# EAGLE design HP85_Tape (EAGLE 9.2.2)

## Sheet 1 of 2
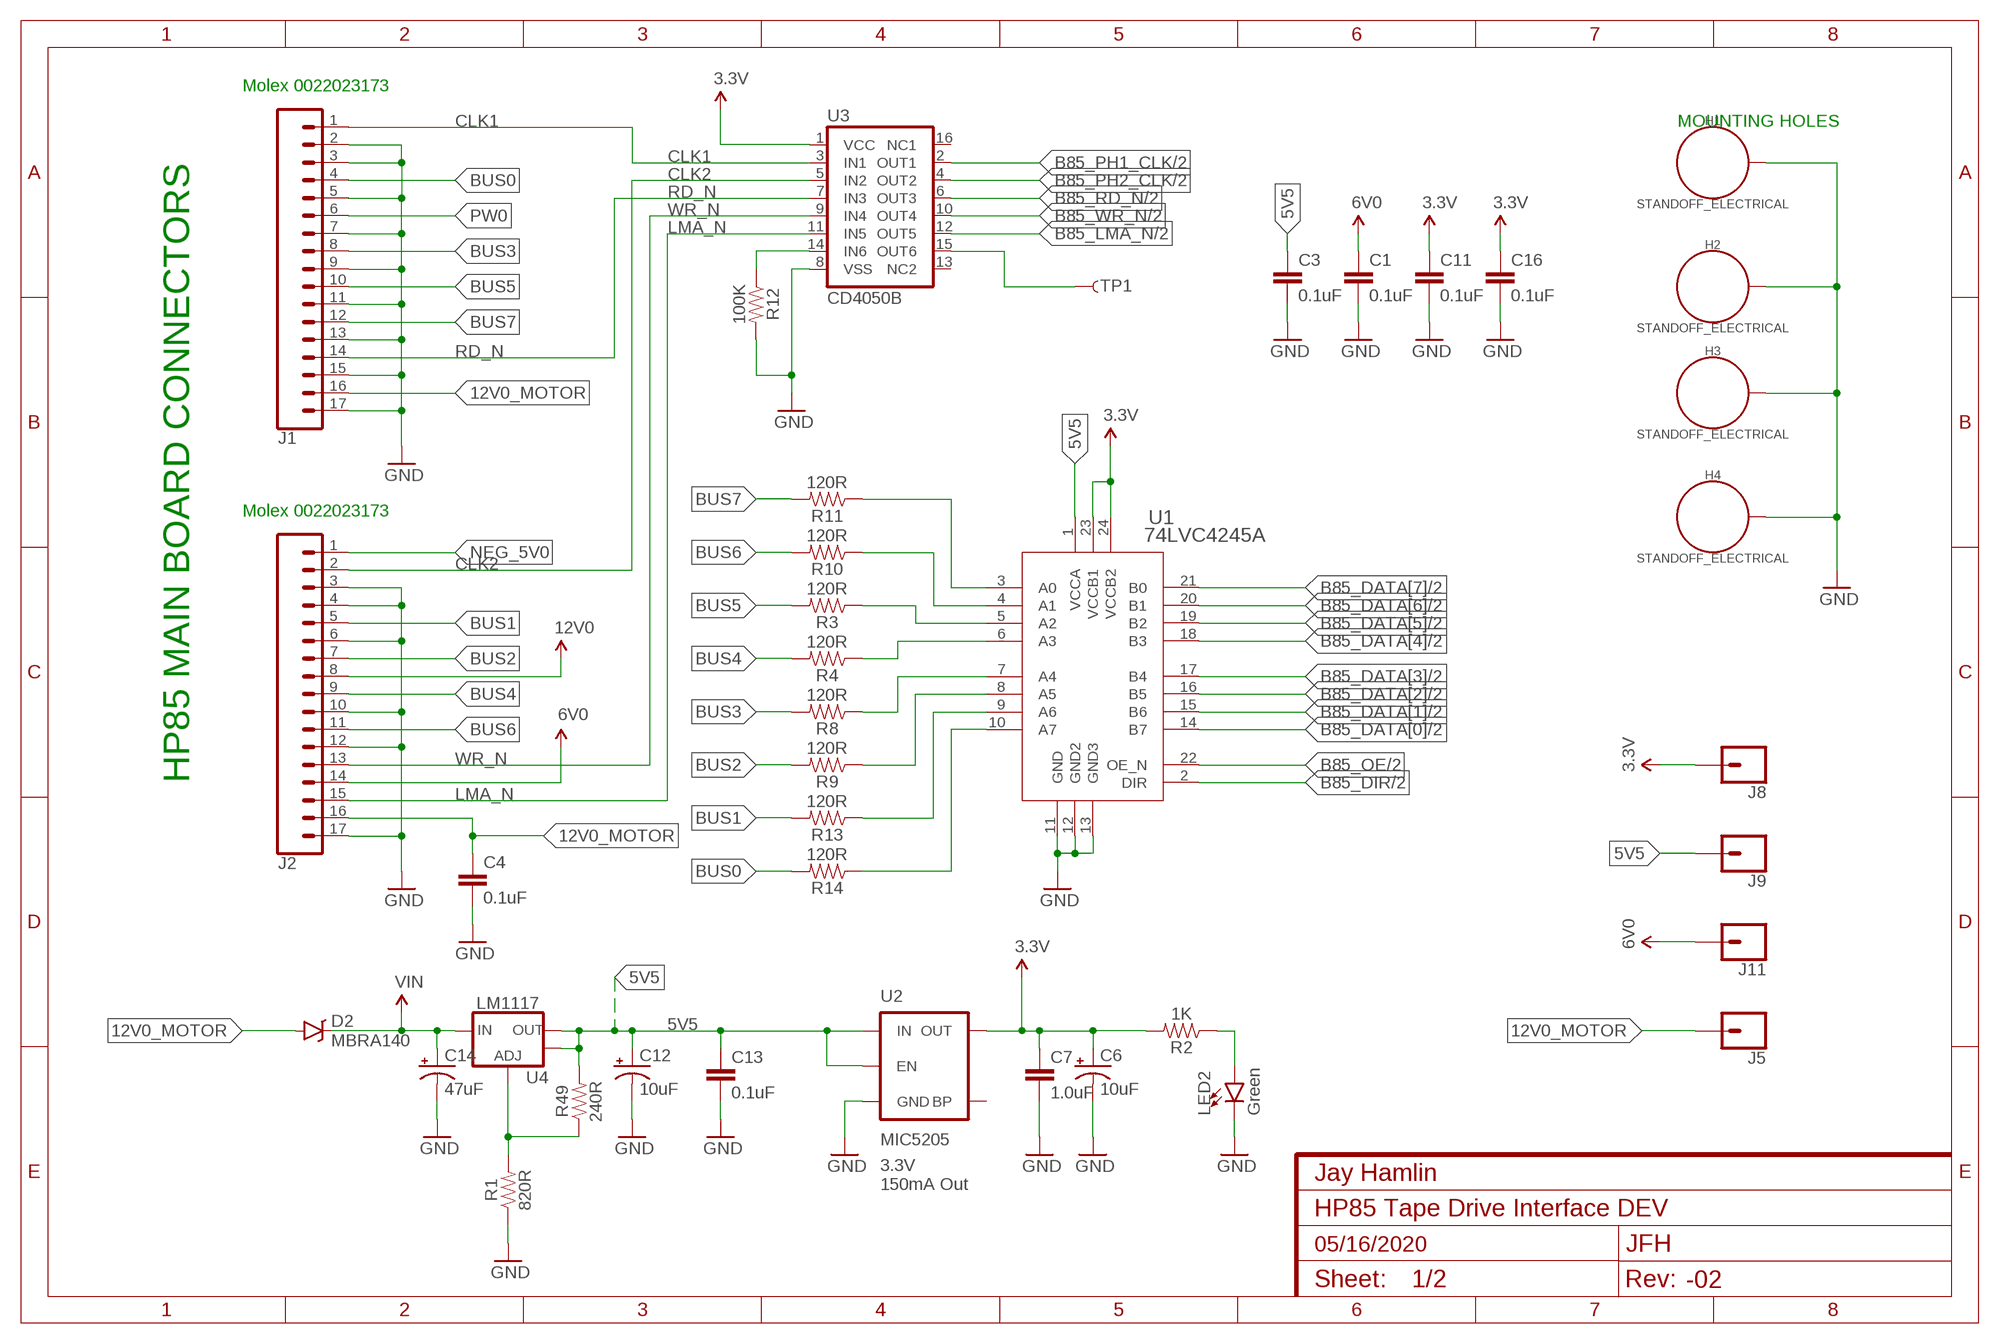
[diagram p0: schematic, sheet 1]

### Parts
C1  0.1uF  0.1UF-0603-25V-(+80/-20%)  [0603]
C3  0.1uF  0.1UF-0603-25V-(+80/-20%)  [0603]
C4  0.1uF  0.1UF-0603-25V-(+80/-20%)  [0603]
C6  10uF  10UF-POLAR-EIA3216-16V-10%(TANT)  [EIA3216]
C7  1.0uF  1.0UF-0603-16V-10%  [0603]
C11  0.1uF  0.1UF-0603-25V-(+80/-20%)  [0603]
C12  10uF  10UF-POLAR-EIA3216-16V-10%(TANT)  [EIA3216]
C13  0.1uF  0.1UF-0603-25V-(+80/-20%)  [0603]
C14  47uF  47UF-POLAR-PANASONIC_D-35V-20%  [PANASONIC_D]
C16  0.1uF  0.1UF-0603-25V-(+80/-20%)  [0603]
D2  MBRA140  [SMA-DIODE]
H1  STANDOFF_ELECTRICAL  [STANDOFF-ELECTRICAL]
H2  STANDOFF_ELECTRICAL  [STANDOFF-ELECTRICAL]
H3  STANDOFF_ELECTRICAL  [STANDOFF-ELECTRICAL]
H4  STANDOFF_ELECTRICAL  [STANDOFF-ELECTRICAL]
J1  CONN_17  [1X17]
J2  CONN_17  [1X17]
J5  CONN_01  [1X01]
J8  CONN_01  [1X01]
J9  CONN_01  [1X01]
J11  CONN_01  [1X01]
LED2  Green  LED1206  [LED-1206]
R1  820R  715OHM-0603-1/10W-1%  [0603]
R2  1K  4.7KOHM-0603-1/10W-1%  [0603]
R3  120R  240OHM-0603-1/10W-1%  [0603]
R4  120R  240OHM-0603-1/10W-1%  [0603]
R8  120R  240OHM-0603-1/10W-1%  [0603]
R9  120R  240OHM-0603-1/10W-1%  [0603]
R10  120R  240OHM-0603-1/10W-1%  [0603]
R11  120R  240OHM-0603-1/10W-1%  [0603]
R12  100K  715OHM-0603-1/10W-1%  [0603]
R13  120R  240OHM-0603-1/10W-1%  [0603]
R14  120R  240OHM-0603-1/10W-1%  [0603]
R49  240R  240OHM-0603-1/10W-1%  [0603]
TP1  TP-3x5  TEST-POINT3X5  [PAD.03X.05]
U1  74LVC4245A  [SO-24-M]
U2  MIC5205  MIC52053.3V  [SOT23-5]
U3  CD4050B  CD4050BHCD  [SO16]
U4  LM1117  V_REG_LM1117ALT1  [SOT223-ALT1]

### Nets
3.3V: C6.+ C7.1 C11.1 C16.1 J8.1 R2.2 U1.23(VCCB1) U1.24(VCCB2) U2.5(OUT) U3.1(VCC) ; also sheet 2
5V5: C3.1 C12.+ C13.1 J9.1 R49.2 U1.1(VCCA) U2.1(IN) U2.3(EN) U4.2(OUT) U4.4(OUT)
6V0: C1.1 J2.14 J11.1
12V0: J2.8
12V0_MOTOR: C4.1 D2.A J1.16 J2.16 J5.1
B85_DATA[0]: U1.14(B7) ; also sheet 2
B85_DATA[1]: U1.15(B6) ; also sheet 2
B85_DATA[2]: U1.16(B5) ; also sheet 2
B85_DATA[3]: U1.17(B4) ; also sheet 2
B85_DATA[4]: U1.18(B3) ; also sheet 2
B85_DATA[5]: U1.19(B2) ; also sheet 2
B85_DATA[6]: U1.20(B1) ; also sheet 2
B85_DATA[7]: U1.21(B0) ; also sheet 2
B85_DIR: U1.2(DIR) ; also sheet 2
B85_LMA_N: U3.12(OUT5) ; also sheet 2
B85_OE: U1.22(OE_N) ; also sheet 2
B85_PH1_CLK: U3.2(OUT1) ; also sheet 2
B85_PH2_CLK: U3.4(OUT2) ; also sheet 2
B85_RD_N: U3.6(OUT3) ; also sheet 2
B85_WR_N: U3.10(OUT4) ; also sheet 2
BUS0: J1.4 R14.2
BUS1: J2.5 R13.2
BUS2: J2.7 R9.2
BUS3: J1.8 R8.2
BUS4: J2.9 R4.2
BUS5: J1.10 R3.2
BUS6: J2.11 R10.2
BUS7: J1.12 R11.2
CLK1: J1.1 U3.3(IN1)
CLK2: J2.2 U3.5(IN2)
GND: C1.2 C3.2 C4.2 C6.- C7.2 C11.2 C12.- C13.2 C14.- C16.2 H1.P1 H2.P1 H3.P1 H4.P1 J1.2 J1.3 J1.5 J1.7 J1.9 J1.11 J1.13 J1.15 J1.17 J2.3 J2.4 J2.6 J2.10 J2.12 J2.17 LED2.C R1.1 R12.2 U1.11(GND) U1.12(GND2) U1.13(GND3) U2.2(GND) U3.8(VSS) ; also sheet 2
LMA_N: J2.15 U3.11(IN5)
N$1: LED2.A R2.1
N$2: R1.2 R49.1 U4.1(ADJ)
N$3: R12.1 U3.14(IN6)
N$4: R14.1 U1.10(A7)
N$5: TP1.P$1 U3.15(OUT6)
N$9: R13.1 U1.9(A6)
N$11: R9.1 U1.8(A5)
N$12: R8.1 U1.7(A4)
N$13: R4.1 U1.6(A3)
N$15: R3.1 U1.5(A2)
N$18: R10.1 U1.4(A1)
N$19: R11.1 U1.3(A0)
NEG_5V0: J2.1
PW0: J1.6
RD_N: J1.14 U3.7(IN3)
VIN: C14.+ D2.C U4.3(IN)
WR_N: J2.13 U3.9(IN4)
Unconnected: U2.4(BP) U3.13(NC2) U3.16(NC1)

### Notes on the sheet
- Molex 0022023173
- MOUNTING HOLES
- Molex 0022023173
- HP85 MAIN BOARD CONNECTORS
- 3.3V
  150mA Out

## Sheet 2 of 2
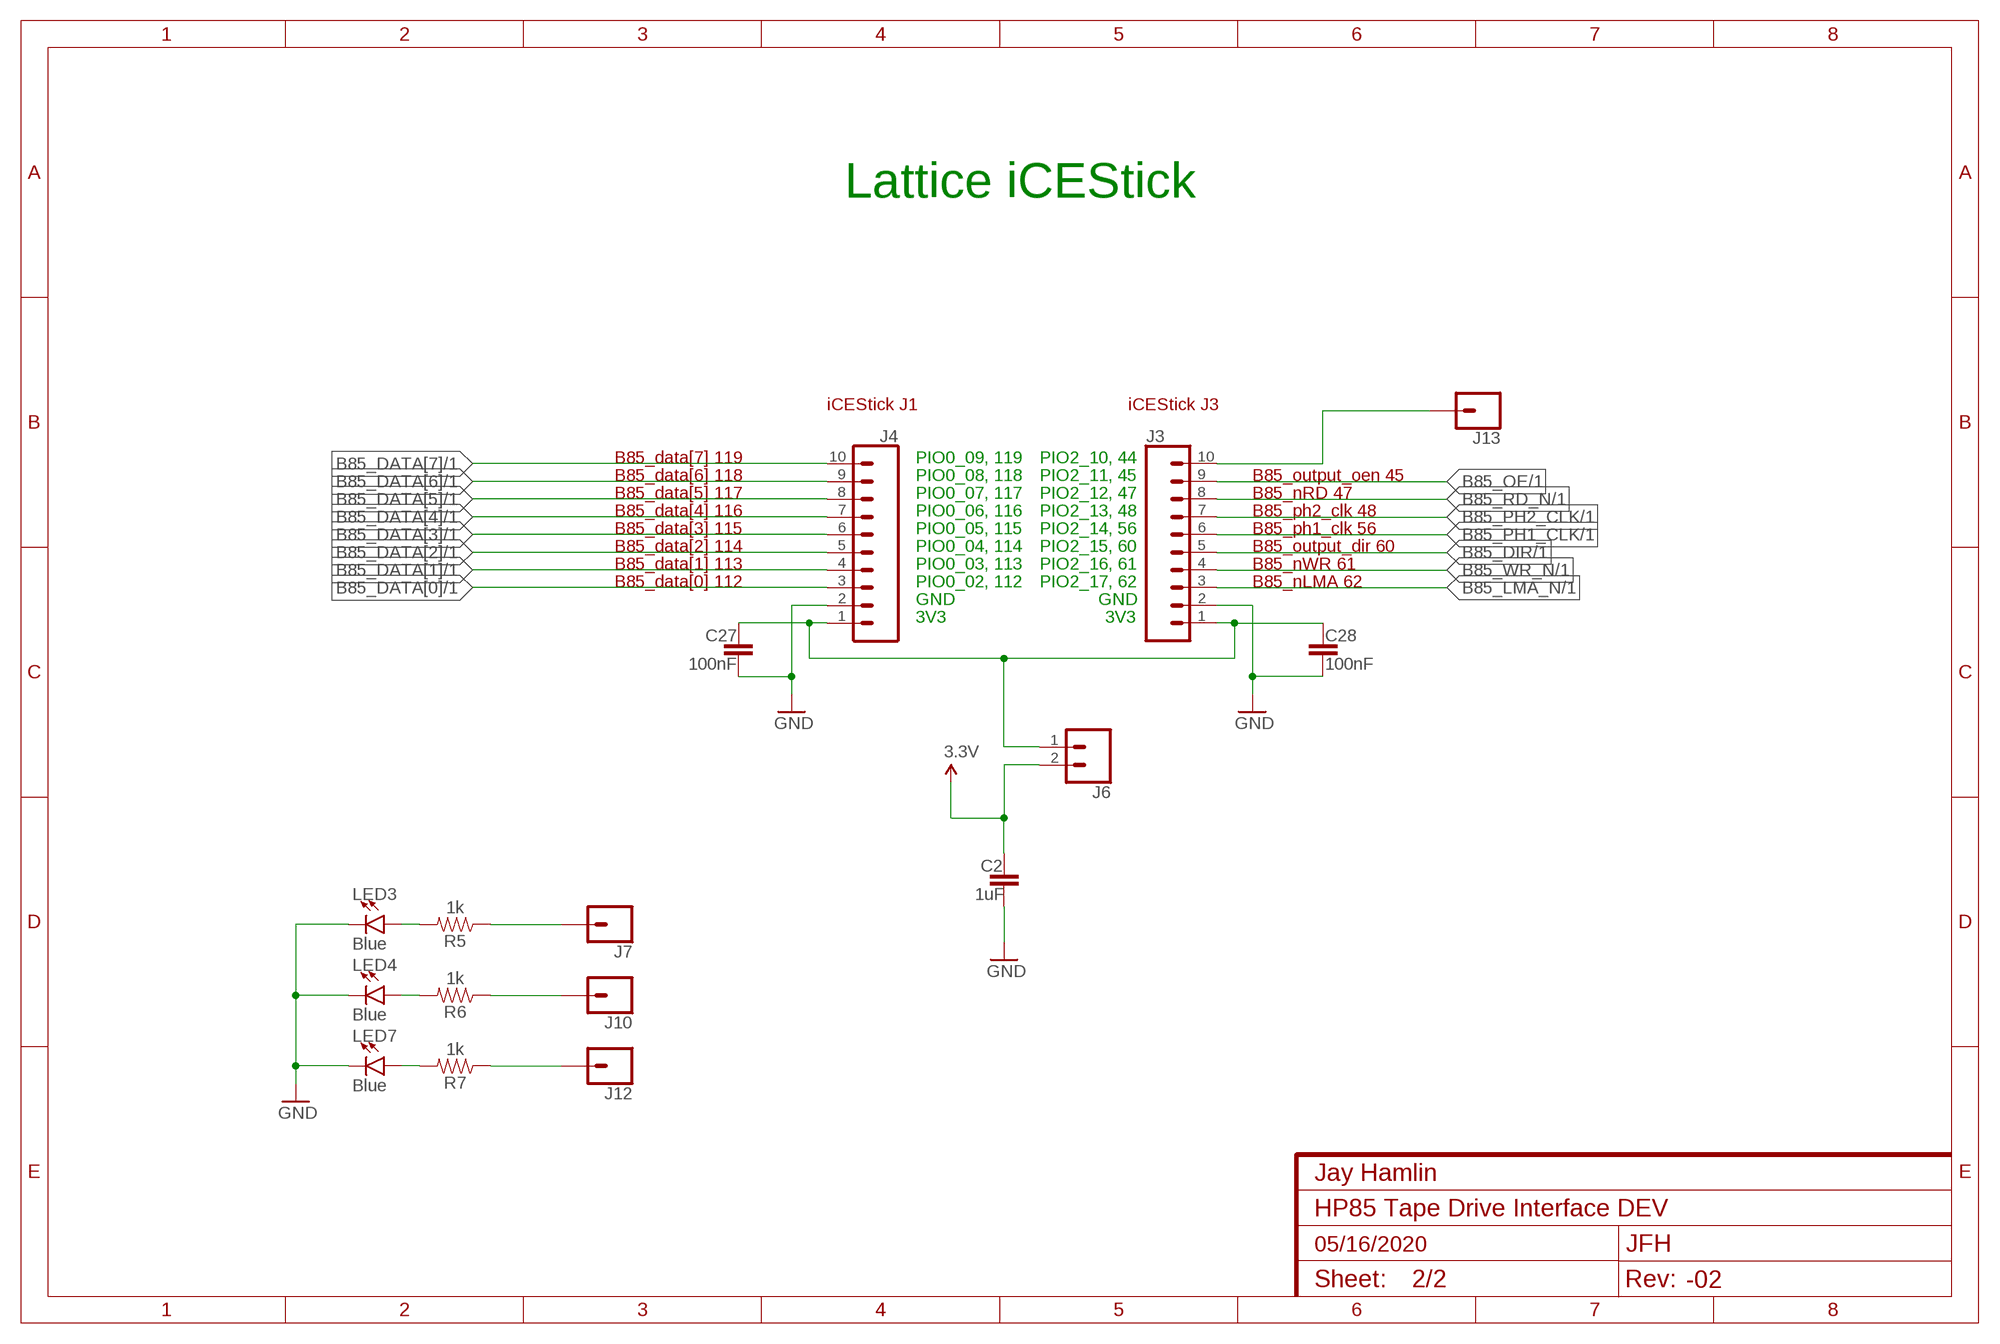
[diagram p1: schematic, sheet 2]

### Parts
C2  1uF  0.1UF-0603-25V-(+80/-20%)  [0603]
C27  100nF  0.1UF-0603-25V-(+80/-20%)  [0603]
C28  100nF  0.1UF-0603-25V-(+80/-20%)  [0603]
J3  CONN_10"  [1X10]
J4  CONN_10"  [1X10]
J6  CONN_02  [1X02]
J7  CONN_01  [1X01]
J10  CONN_01  [1X01]
J12  CONN_01  [1X01]
J13  CONN_01  [1X01]
LED3  Blue  LED1206  [LED-1206]
LED4  Blue  LED1206  [LED-1206]
LED7  Blue  LED1206  [LED-1206]
R5  1k  1KOHM-0603-1/10W-1%  [0603]
R6  1k  1KOHM-0603-1/10W-1%  [0603]
R7  1k  1KOHM-0603-1/10W-1%  [0603]

### Nets
3.3V: C2.1 J6.2 ; also sheet 1
B85_DATA[0]: J4.3 ; also sheet 1
B85_DATA[1]: J4.4 ; also sheet 1
B85_DATA[2]: J4.5 ; also sheet 1
B85_DATA[3]: J4.6 ; also sheet 1
B85_DATA[4]: J4.7 ; also sheet 1
B85_DATA[5]: J4.8 ; also sheet 1
B85_DATA[6]: J4.9 ; also sheet 1
B85_DATA[7]: J4.10 ; also sheet 1
B85_DIR: J3.5 ; also sheet 1
B85_LMA_N: J3.3 ; also sheet 1
B85_OE: J3.9 ; also sheet 1
B85_PH1_CLK: J3.6 ; also sheet 1
B85_PH2_CLK: J3.7 ; also sheet 1
B85_RD_N: J3.8 ; also sheet 1
B85_WR_N: J3.4 ; also sheet 1
GND: C2.2 C27.2 C28.2 J3.2 J4.2 LED3.C LED4.C LED7.C ; also sheet 1
N$6: LED3.A R5.2
N$7: LED4.A R6.2
N$8: LED7.A R7.2
N$10: J12.1 R7.1
N$14: C27.1 C28.1 J3.1 J4.1 J6.1
N$16: J10.1 R6.1
N$17: J7.1 R5.1
N$20: J3.10 J13.1

### Notes on the sheet
- Lattice iCEStick
- iCEStick J1 | iCEStick J3
- B85_data[7] 119 | PIO0_09, 119 | PIO2_10, 44
- B85_data[6] 118 | PIO0_08, 118 | PIO2_11, 45 | B85_output_oen 45
- B85_data[5] 117 | PIO0_07, 117 | PIO2_12, 47 | B85_nRD 47
- B85_data[4] 116 | PIO0_06, 116 | PIO2_13, 48 | B85_ph2_clk 48
- B85_data[3] 115 | PIO0_05, 115 | PIO2_14, 56 | B85_ph1_clk 56
- B85_data[2] 114 | PIO0_04, 114 | PIO2_15, 60 | B85_output_dir 60
- B85_data[1] 113 | PIO0_03, 113 | PIO2_16, 61 | B85_nWR 61
- B85_data[0] 112 | PIO0_02, 112 | PIO2_17, 62 | B85_nLMA 62
- GND | GND
- 3V3 | 3V3

## Library data of the parts
C1 C3 C4 C11 C13 C16 = SparkFun-Capacitors:0.1UF: 0.1µF ceramic capacitors A capacitor is a passive two-terminal electrical component used to store electrical energy temporarily in an electric field.; PROD_ID: CAP-00810
C2 C27 C28 = SparkFun-Capacitors:0.1UF: 0.1µF ceramic capacitors A capacitor is a passive two-terminal electrical component used to store electrical energy temporarily in an electric field.; PROD_ID: CAP-00810; VALUE: 0.1uF
C6 C12 = SparkFun-Capacitors:10UF-POLAR: 10.0µF polarized capacitors A capacitor is a passive two-terminal electrical component used to store electrical energy temporarily in an electric field.; PROD_ID: CAP-00811
C7 = SparkFun-Capacitors:1.0UF: 1µF ceramic capacitors A capacitor is a passive two-terminal electrical component used to store electrical energy temporarily in an electric field.; PROD_ID: CAP-00868
C14 = SparkFun-Capacitors:47UF-POLAR: 47µF polarized capacitors A capacitor is a passive two-terminal electrical component used to store electrical energy temporarily in an electric field.; PROD_ID: CAP-08478
D2 = SparkFun-DiscreteSemi:MBRA140: 40V, 1A Schottky rectifier SMA/DO-214AC package DIO-08053; PROD_ID: DIO-08053
H1-H4 = SparkFun-Hardware:STANDOFF_ELECTRICAL: Stand Off Drill holes with an electrical connection. For example, use these to ground your board to a chassis. Example SparkFun Products Screw - Phillips Head (1/4", 4-40, 10 pack) <https://www.sparkfun.com/products/10453> (PRT-10453) Screw - Phillips Head (1/2", 4-40, 10 pack) <https://www.sparkfun.com/products/10452> (PRT-10452) Screw - Phillips Head (3/4", 4-40, 10 pack) <https://www.sparkfun.com/products/10451> (PRT-10451) Screw - Phillips Head (1", 4-40, 10 pack) <https://www.sparkfun.com/products/10450> (PRT-10450)
J1 J2 = SparkFun-Connectors:CONN_17: Multi connection point. Often used as Generic Header-pin footprint for 0.1 inch spaced/style header connections On any of the 0.1 inch spaced packages, you can populate with these: Break Away Headers - Straight <https://www.sparkfun.com/products/116> (PRT-00116) Break Away Male Headers - Right Angle <https://www.sparkfun.com/products/553> (PRT-00553) Female Headers <https://www.sparkfun.com/products/115> (PRT-00115) Break Away Headers - Machine Pin <https://www.sparkfun.com/products/117> (PRT-00117) Break Away Female Headers - Swiss Machine Pin <https://www.sparkfun.com/products/743> (PRT-00743) For SCREWTERMINALS and SPRING TERMINALS visit here: Screw Terimnals on SparkFun.com <https://www.sparkfun.com/search/results?term=Screw+Terminals> (5mm/3.5mm/2.54mm spacing) This device is also useful as a general connection point to wire up your design to another part of your project. Our various solder wires solder well into these plated through hole pads. Hook-Up Wire - Assortment (Stranded, 22 AWG) <https://www.sparkfun.com/products/11375> (PRT-11375) Hook-Up Wire - Assortment (Solid Core, 22 AWG) <https://www.sparkfun.com/products/11367> (PRT-11367) View the entire wire category on our website here <https://www.sparkfun.com/categories/141> Special notes: Molex polarized connector foot print use with SKU : PRT-08231 with associated crimp pins and housings. 1MM SMD Version SKU: PRT-10208 NOTES ON THE VARIANTS LOCK and LOCK_LONGPADS... This footprint was designed to help hold the alignment of a through-hole component (i.e. 6-pin header) while soldering it into place. You may notice that each hole has been shifted either up or down by 0.005 of an inch from it's more standard position (which is a perfectly straight line). This slight alteration caused the pins (the squares in the middle) to touch the edges of the holes. Because they are alternating, it causes a "brace" to hold the component in place. 0.005 has proven to be the perfect amount of "off-center" position when using our standard breakaway headers. Although looks a little odd when you look at the bare footprint, once you have a header in there, the alteration is very hard to notice. Also,if you push a header all the way into place, it is covered up entirely on the bottom side.
J3 J4 = SparkFun-Connectors:CONN_10: Multi connection point. Often used as Generic Header-pin footprint for 0.1 inch spaced/style header connections On any of the 0.1 inch spaced packages, you can populate with these: Break Away Headers - Straight <https://www.sparkfun.com/products/116> (PRT-00116) Break Away Male Headers - Right Angle <https://www.sparkfun.com/products/553> (PRT-00553) Female Headers <https://www.sparkfun.com/products/115> (PRT-00115) Break Away Headers - Machine Pin <https://www.sparkfun.com/products/117> (PRT-00117) Break Away Female Headers - Swiss Machine Pin <https://www.sparkfun.com/products/743> (PRT-00743) Arduino Stackable Header - 10 Pin <https://www.sparkfun.com/products/11376> (PRT-11376) For SCREWTERMINALS and SPRING TERMINALS visit here: Screw Terimnals on SparkFun.com <https://www.sparkfun.com/search/results?term=Screw+Terminals> (5mm/3.5mm/2.54mm spacing) This device is also useful as a general connection point to wire up your design to another part of your project. Our various solder wires solder well into these plated through hole pads. Hook-Up Wire - Assortment (Stranded, 22 AWG) <https://www.sparkfun.com/products/11375> (PRT-11375) Hook-Up Wire - Assortment (Solid Core, 22 AWG) <https://www.sparkfun.com/products/11367> (PRT-11367) View the entire wire category on our website here <https://www.sparkfun.com/categories/141> Special notes: Molex polarized connector foot print use with SKU : PRT-08231 with associated crimp pins and housings. 1MM SMD Version SKU: PRT-10208 NOTES ON THE VARIANTS LOCK and LOCK_LONGPADS... This footprint was designed to help hold the alignment of a through-hole component (i.e. 6-pin header) while soldering it into place. You may notice that each hole has been shifted either up or down by 0.005 of an inch from it's more standard position (which is a perfectly straight line). This slight alteration caused the pins (the squares in the middle) to touch the edges of the holes. Because they are alternating, it causes a "brace" to hold the component in place. 0.005 has proven to be the perfect amount of "off-center" position when using our standard breakaway headers. Although looks a little odd when you look at the bare footprint, once you have a header in there, the alteration is very hard to notice. Also,if you push a header all the way into place, it is covered up entirely on the bottom side.; PROD_ID: CONN-11563
J5 J7-J13 = SparkFun-Connectors:CONN_01: Single connection point. Often used as Generic Header-pin footprint for 0.1 inch spaced/style header connections On any of the 0.1 inch spaced packages, you can populate with these: Break Away Headers - Straight <https://www.sparkfun.com/products/116> (PRT-00116) Break Away Male Headers - Right Angle <https://www.sparkfun.com/products/553> (PRT-00553) Female Headers <https://www.sparkfun.com/products/115> (PRT-00115) Break Away Headers - Machine Pin <https://www.sparkfun.com/products/117> (PRT-00117) Break Away Female Headers - Swiss Machine Pin <https://www.sparkfun.com/products/743> (PRT-00743) This device is also useful as a general connection point to wire up your design to another part of your project. Our various solder wires solder well into these plated through hole pads. Hook-Up Wire - Assortment (Stranded, 22 AWG) <https://www.sparkfun.com/products/11375> (PRT-11375) Hook-Up Wire - Assortment (Solid Core, 22 AWG) <https://www.sparkfun.com/products/11367> (PRT-11367) View the entire wire category on our website here <https://www.sparkfun.com/categories/141> Special notes: SMTSO-256-ET is a "flush mount" nut for a 4-40 screw. We mostly use this on specialty testbeds; it is a nice way to connect hardware to your PCB at an adjustable hieght. Also note, the SNAP packages are for using a snappable style connector. We sell a baggie of snaps and they are also used on two LilyPad designs: Snap Assortment - 30 pack (male and female) <https://www.sparkfun.com/products/11347> (DEV-11347) LilyPad Arduino SimpleSnap <https://www.sparkfun.com/products/10941> (DEV-10941) LilyPad SimpleSnap Protoboard <https://www.sparkfun.com/products/10940> (DEV-10940)
J6 = SparkFun-Connectors:CONN_02: Multi connection point. Often used as Generic Header-pin footprint for 0.1 inch spaced/style header connections On any of the 0.1 inch spaced packages, you can populate with these: Break Away Headers - Straight <https://www.sparkfun.com/products/116> (PRT-00116) Break Away Male Headers - Right Angle <https://www.sparkfun.com/products/553> (PRT-00553) Female Headers <https://www.sparkfun.com/products/115> (PRT-00115) Break Away Headers - Machine Pin <https://www.sparkfun.com/products/117> (PRT-00117) Break Away Female Headers - Swiss Machine Pin <https://www.sparkfun.com/products/743> (PRT-00743) For SCREWTERMINALS and SPRING TERMINALS visit here: Screw Terimnals on SparkFun.com <https://www.sparkfun.com/search/results?term=Screw+Terminals> (5mm/3.5mm/2.54mm spacing) This device is also useful as a general connection point to wire up your design to another part of your project. Our various solder wires solder well into these plated through hole pads. Hook-Up Wire - Assortment (Stranded, 22 AWG) <https://www.sparkfun.com/products/11375> (PRT-11375) Hook-Up Wire - Assortment (Solid Core, 22 AWG) <https://www.sparkfun.com/products/11367> (PRT-11367) View the entire wire category on our website here <https://www.sparkfun.com/categories/141> Special notes: Molex polarized connector foot print use with: PRT-08233 with associated crimp pins and housings. 2.54_SCREWTERM for use with PRT-10571. 3.5mm Screw Terminal footprints for PRT-08084 5mm Screw Terminal footprints for use with PRT-08432
LED2 = SparkFun-LED:LED: LED (Generic) Standard schematic elements and footprints for 5mm, 3mm, 1206, and 0603 sized LEDs. Generic LEDs with no color specified.; PROD_ID: DIO-09910
LED3 LED4 LED7 = SparkFun-LED:LED: LED (Generic) Standard schematic elements and footprints for 5mm, 3mm, 1206, and 0603 sized LEDs. Generic LEDs with no color specified.; PROD_ID: DIO-09911
R1 R12 = SparkFun-Resistors:715OHM: 715Ω resistor A resistor is a passive two-terminal electrical component that implements electrical resistance as a circuit element. Resistors act to reduce current flow, and, at the same time, act to lower voltage levels within circuits.; PROD_ID: RES-07850; VALUE: 715
R2 = SparkFun-Resistors:4.7KOHM: 4.7kΩ resistor A resistor is a passive two-terminal electrical component that implements electrical resistance as a circuit element. Resistors act to reduce current flow, and, at the same time, act to lower voltage levels within circuits.; PROD_ID: RES-07857; VALUE: 4.7k
R3 R4 R8-R11 R13 R14 R49 = SparkFun-Resistors:240OHM: 240Ω resistor A resistor is a passive two-terminal electrical component that implements electrical resistance as a circuit element. Resistors act to reduce current flow, and, at the same time, act to lower voltage levels within circuits.; PROD_ID: RES-07849; VALUE: 240
R5-R7 = SparkFun-Resistors:1KOHM: 1kΩ resistor A resistor is a passive two-terminal electrical component that implements electrical resistance as a circuit element. Resistors act to reduce current flow, and, at the same time, act to lower voltage levels within circuits.; PROD_ID: RES-07856
TP1 = SparkFun-Connectors:TEST-POINT: Bare copper test points for troubleshooting or ICT
U1 = JaysOWL_Library:74LVC4245A
U2 = SparkFun-PowerIC:MIC5205: MIC5205 150mA vreg 3.3V - VREG-00822 5V - VREG-00823; PROD_ID: VREG-00822
U3 = JaysOWL_Library:CD4050B: Dual 4:1 Analog Mux Dual four-channel analog MULTIPLEXER / DEMULTIPLEXER SparkFun Products SparkFun Vernier Interface Shield <https://www.sparkfun.com/products/12858> (DEV-12858); PROD_ID: IC-13103; VALUE: 74HC4052D
U4 = Testing:V_REG_LM1117: Voltage Regulator LM1117 Standard adjustable voltage regulator but in SMD form. Spark Fun Electronics SKU : COM-00595; PROD_ID: VREG-08170

## Net classes
0 default: width 0.102 mm, drill 0.305 mm, clearance 0.102 mm

## Board
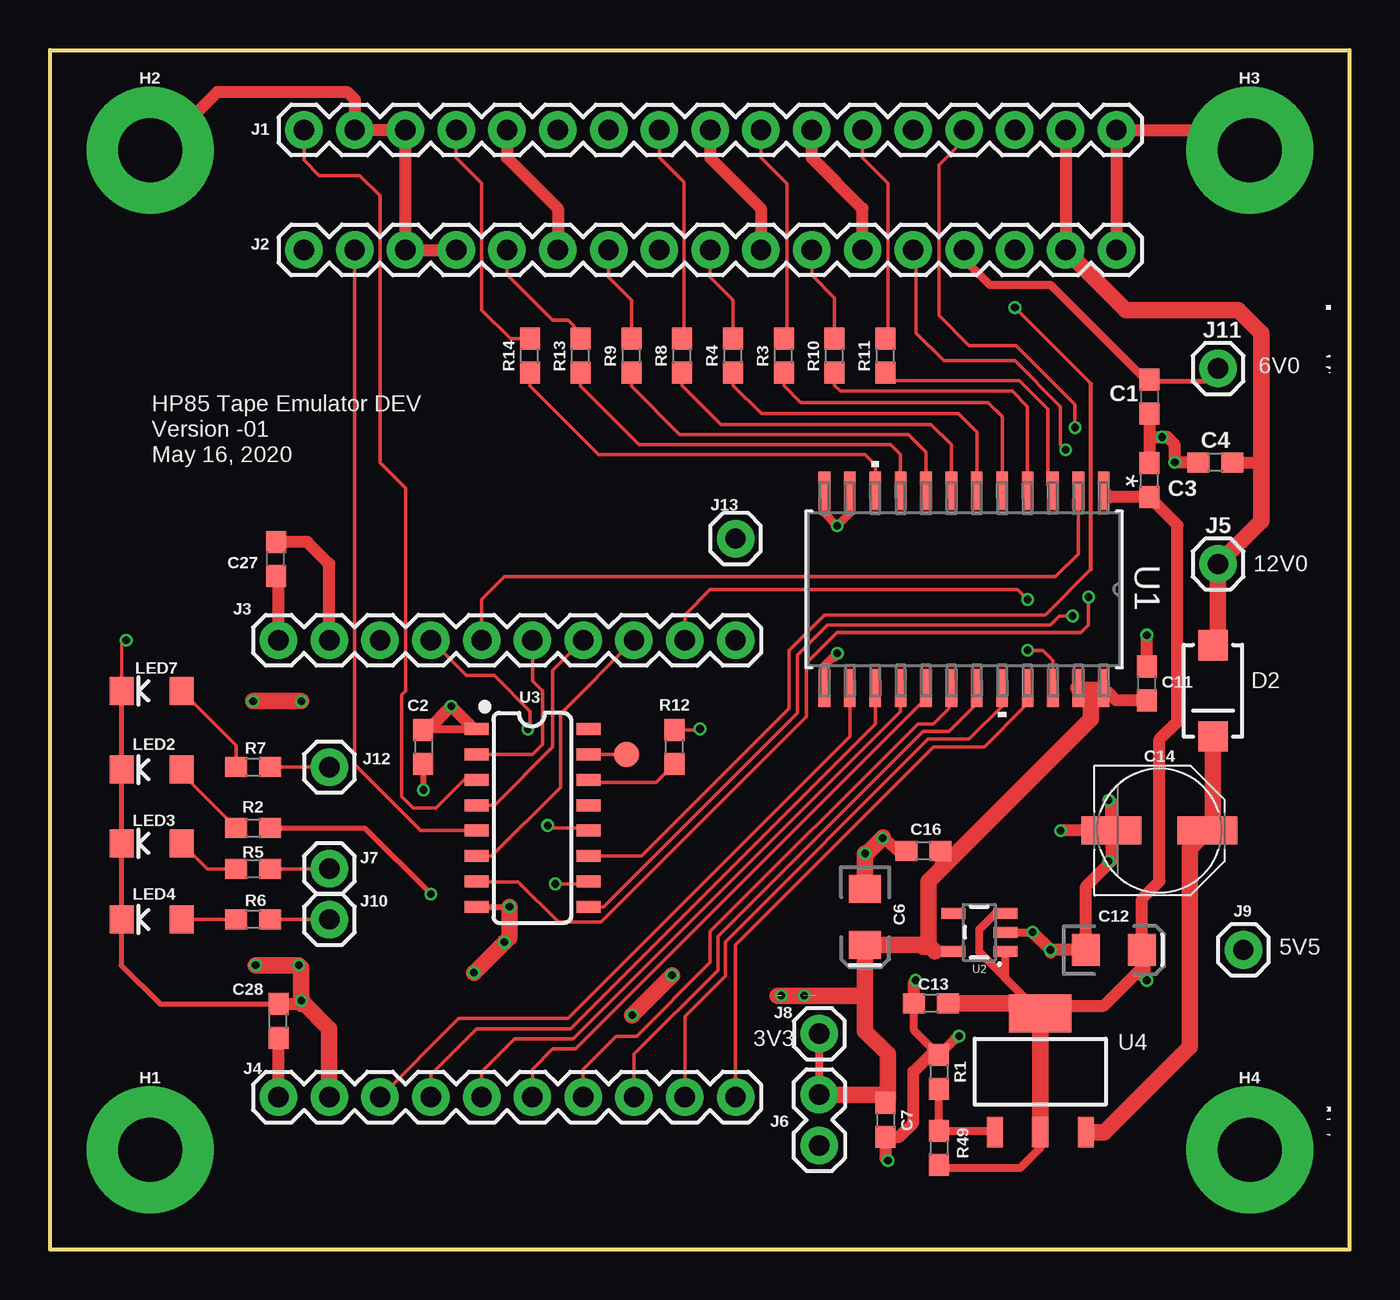
[diagram p2: board, top side]
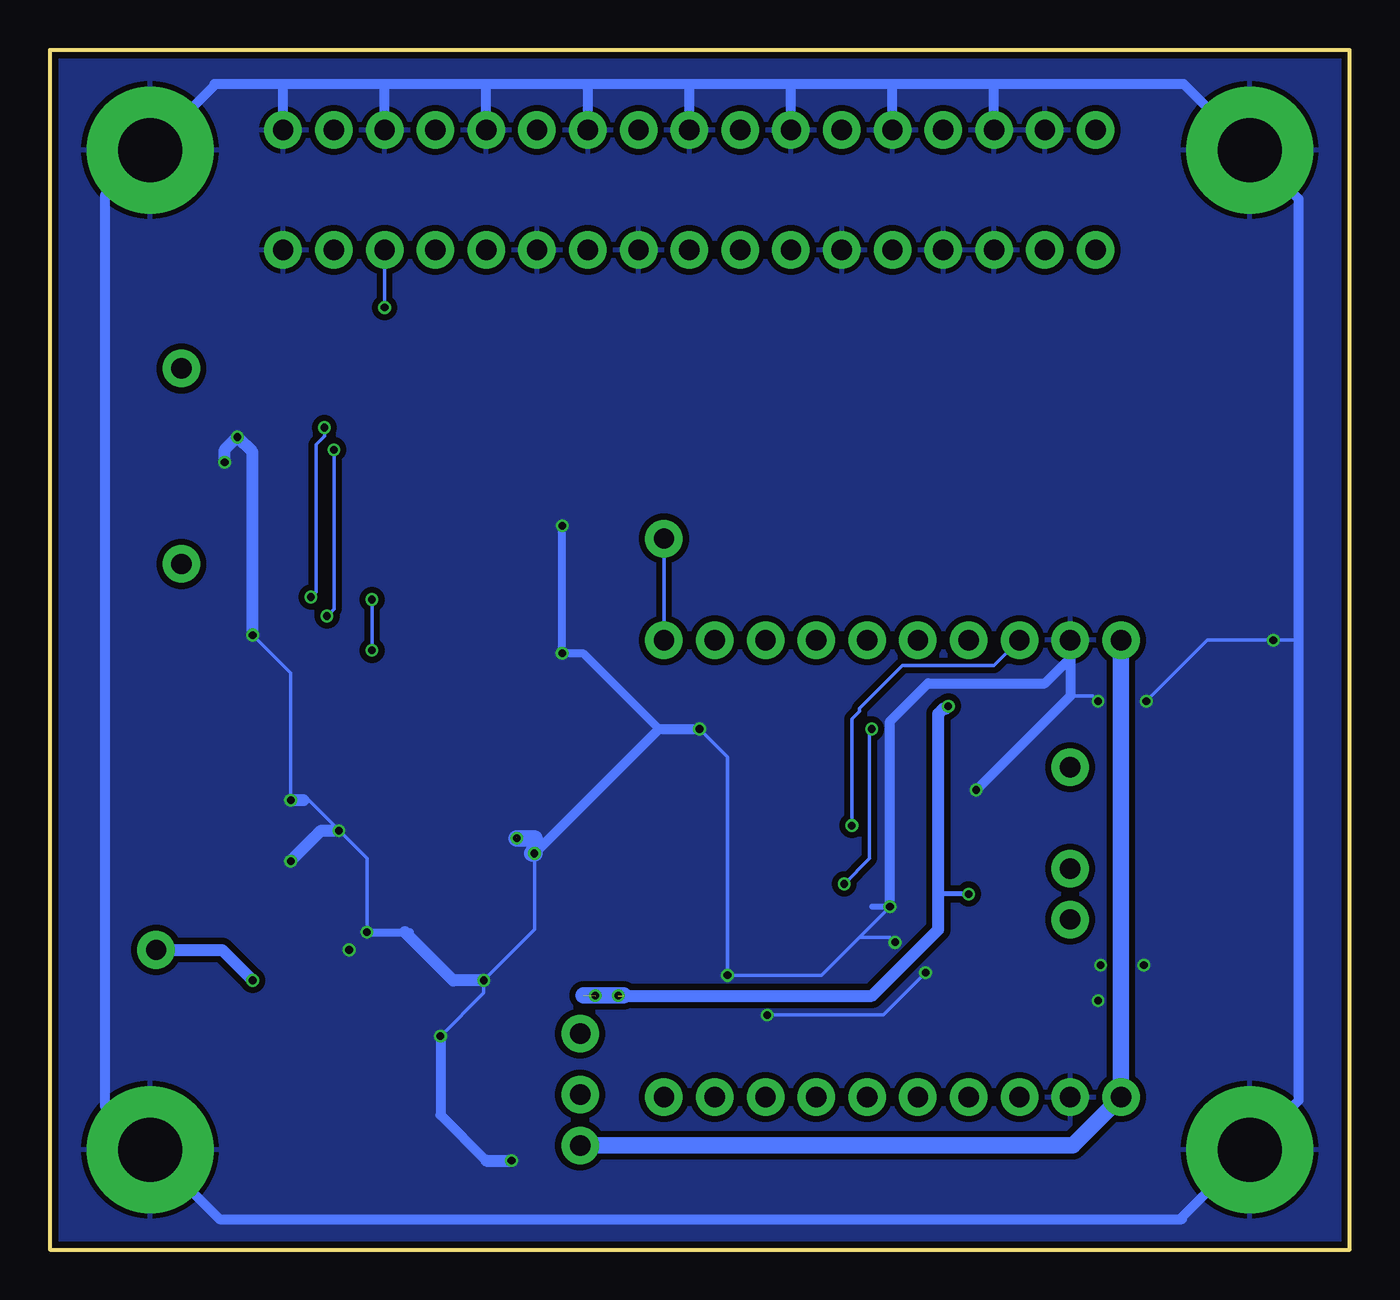
[diagram p3: board, bottom side, seen from below]

Size 65 x 60 mm. Coordinates in mm from the lower left corner, seen from the top.
Outline: 0,60 65,60 65,0 0,0 0,60
Copper layers (1*16): Top 0.035mm / dielectric 1.5mm / Bottom 0.035mm
Design rules "SparkFun-2-layer-FAB-LIMIT": minimum track width 4mil, minimum drill 6mil, track to track 4mil, track to pad 4mil, pad to pad 4mil, via to via 4mil, smd to smd 4mil, copper to edge 4mil, drill to drill 4mil, minimum pad ring 5mil, minimum via ring 5mil, stop-mask expansion 4mil, vias tented up to drill 25mil, thermal gap 10mil
vRestrict: area 0.6,22.4 to 2,30.6; area 5.7,23.1 to 7.4,30.6; area 47.9,10.8 to 48.5,11.3; area 50.4,10.7 to 50.9,11.6; area 11.3,29.3 to 12.7,31.6; area 0.3,13 to 9.4,25

### Footprints (pad centres in the part's own frame; a part is rotated, then mirrored left to right if it is on the bottom)
0603 = smd 1.1 x 1: 1 -0.85,0; 2 0.85,0
EIA3216 = smd 1.4 x 1.6: + 1.4,0; - -1.4,0
PANASONIC_D = smd 3 x 1.4: + 2.4,0; - -2.4,0
SMA-DIODE = smd 1.524 x 1.47: A -2.277,0; C 2.277,0
STANDOFF-ELECTRICAL = drill 3.2 pad 6.35: P1 0,0
1X17 = drill 1.016 pad 1.88: 1 0,0; 2 2.54,0; 3 5.08,0; 4 7.62,0; 5 10.16,0; 6 12.7,0; 7 15.24,0; 8 17.78,0; 9 20.32,0; 10 22.86,0; 11 25.4,0; 12 27.94,0; 13 30.48,0; 14 33.02,0; 15 35.56,0; 16 38.1,0; 17 40.64,0
1X10 = drill 1.016 pad 1.88: 1 0,0; 2 2.54,0; 3 5.08,0; 4 7.62,0; 5 10.16,0; 6 12.7,0; 7 15.24,0; 8 17.78,0; 9 20.32,0; 10 22.86,0
1X01 = drill 1.016 pad 1.88: 1 0,0
1X02 = drill 1.016 pad 1.88: 1 0,0; 2 2.54,0
LED-1206 = smd 1.2 x 1.4: A -1.5,0; C 1.5,0
PAD.03X.05 = smd 1.27 x 1.27: P$1 0,0
SO-24-M = smd 1.905 x 0.584: 1 -4.928,6.985; 2 -4.928,5.715; 3 -4.928,4.445; 4 -4.928,3.175; 5 -4.928,1.905; 6 -4.928,0.635; 7 -4.928,-0.635; 8 -4.928,-1.905; 9 -4.928,-3.175; 10 -4.928,-4.445; 11 -4.928,-5.715; 12 -4.928,-6.985; 13 4.928,-6.985; 14 4.928,-5.715; 15 4.928,-4.445; 16 4.928,-3.175; 17 4.928,-1.905; 18 4.928,-0.635; 19 4.928,0.635; 20 4.928,1.905; 21 4.928,3.175; 22 4.928,4.445; 23 4.928,5.715; 24 4.928,6.985
SOT23-5 = smd 0.55 x 1.2: 1 -0.95,-1.3; 2 0,-1.3; 3 0.95,-1.3; 4 0.95,1.3; 5 -0.95,1.3
SO16 = smd 0.6 x 1.2: 1 -4.445,-2.8; 2 -3.175,-2.8; 3 -1.905,-2.8; 4 -0.635,-2.8; 5 0.635,-2.8; 6 1.905,-2.8; 7 3.175,-2.8; 8 4.445,-2.8; 9 4.445,2.8; 10 3.175,2.8; 11 1.905,2.8; 12 0.635,2.8; 13 -0.635,2.8; 14 -1.905,2.8; 15 -3.175,2.8; 16 -4.445,2.8
SOT223-ALT1 = smd 0.813 x 1.524: 1 -2.271,-3.02; 2 0,-3.02; 3 2.288,-3.02 | smd 3.124 x 1.905: 4 0,2.921

### Placement (x,y rotation side)
C1  54.99,42.67 270 top
C2  18.67,25.15 270 top
C3  54.99,38.48 90 top
C4  58.29,39.37 180 top
C6  40.77,16.64 270 top
C7  41.78,6.48 270 top
C11  54.86,28.32 90 top
C12  53.21,14.99 0 top
C13  44.07,12.32 180 top
C14  55.5,20.95 0 top
C16  43.69,19.94 180 top
C27  11.3,34.54 90 top
C28  11.43,11.43 90 top
D2  58.17,27.94 270 top
H1  5,5 0 top
H2  5,55 0 top
H3  60,55 0 top
H4  60,5 0 top
J1  12.7,56 0 top
J2  12.7,50 0 top
J3  11.43,30.48 0 top
J4  11.43,7.62 0 top
J5  58.42,34.29 0 top
J6  38.48,5.21 90 top
J7  13.97,19.05 0 top
J8  38.48,10.79 0 top
J9  59.69,14.99 0 top
J10  13.97,16.51 0 top
J11  58.42,44.07 0 top
J12  13.97,24.13 0 top
J13  34.29,35.56 0 top
LED2  5.08,24 180 top
LED3  5.08,20.32 180 top
LED4  5.08,16.51 180 top
LED7  5.08,27.94 180 top
R1  44.45,8.89 270 top
R2  10.16,21.08 0 top
R3  36.7,44.7 90 top
R4  34.16,44.7 90 top
R5  10.16,19.05 180 top
R6  10.16,16.51 180 top
R7  10.16,24.13 180 top
R8  31.62,44.7 90 top
R9  29.08,44.7 90 top
R10  39.24,44.7 90 top
R11  41.78,44.7 90 top
R12  31.24,25.15 90 top
R13  26.54,44.7 90 top
R14  24,44.7 90 top
R49  44.45,5.08 270 top
TP1  28.83,24.77 0 top
U1  45.72,33.02 270 top
U2  46.48,15.88 90 top
U3  24.13,21.59 270 top
U4  49.53,8.89 0 top

### Tracks (layer width: path | path; a pad name or v marks a point on that pad's centre or on a via)
3.3V  (via drill 0.38)  (3 unrouted)
  Top 0.254: R2.2 15.75,21.08 v19.05,17.78
  Top 0.406: C2.1 18.71,26.04 U3.1 | J6.2 J8.1 | U2.5 44.26,14.93 43.62,14.93 43.56,14.99
  Top 0.61: C16.1 44.54,19.01 | 36.83,12.7 v36.58,12.7 | C2.1 18.88,26 v20.07,27.18 21.21,26.04 U3.1 | C11.1 53.33,27.47 U1.24 U1.23
  Top 0.813: 41.91,7.62 41.91,7.45 C7.1 | 44.26,14.93 43.95,15.24 | 43.95,15.24 C6.+ 40.77,12.7 | 41.91,7.62 41.78,7.75 J6.2 | 41.91,7.62 41.91,9.78 40.77,10.92 40.77,12.7 | 36.38,12.7 40.77,12.7 | U1.23 51.97,27.56 52.07,27.56 52.07,26.54 44.54,19.01 43.95,18.41 43.95,15.24
  Bottom 0.254: v19.05,17.78 20.57,17.78
  Bottom 0.61: v36.58,12.7 23.88,12.7 20.57,16 20.57,17.78 20.57,26.8 20.32,27.05 20.19,27.05 v20.07,27.18
  Bottom 0.813: 36.31,12.7 38.31,12.7
  other vias: 37.72,12.7
5V5  (via drill 0.38)
  Top 0.406: U4.2 49.53,5.08 48.51,4.06 44.62,4.06 R49.2 | U4.4 47.78,13.56 47.78,13.59 | 47.78,13.59 U2.1 | 47.78,13.59 46.48,14.89 46.48,16.02 47.28,16.82 U2.3
  Top 0.61: U1.1 53.02,37.63 C3.1 56.39,36.23 56.39,26.42 55.5,25.53 55.5,18.41 54.61,17.53 C12.+ | C12.+ 54.61,14.1 52.7,12.19 49.91,12.19 U4.4 | v54.86,13.46 54.74,13.59 54.74,14.86 C12.+
  Top 0.813: C13.1 49.02,12.32 U4.4 U4.2
  Bottom 0.61: J9.1 56.39,14.99 v54.86,13.46
6V0
  Top 0.254: C1.1 55.08,43.43 57.78,43.43 J11.1
  Top 0.406: J2.14 45.72,49.53 46.99,48.26 50.04,48.26 54.78,43.52 C1.1
12V0_MOTOR
  Top 0.61: J1.16 J2.16 | C4.1 60.58,39.37 | 58.42,30.47 D2.A
  Top 0.813: J2.16 53.81,46.99 59.44,46.99 60.58,45.85 60.58,39.37 60.58,36.45 J5.1 58.42,30.47
B85_DATA[0]
  Top 0.178: J4.3 20.45,11.56 25.91,11.56 40.01,25.65 U1.14
B85_DATA[1]
  Top 0.178: J4.4 19.05,8.76 21.34,11.05 26.04,11.05 41.27,26.29 U1.15
B85_DATA[2]
  Top 0.178: J4.5 21.59,8.89 23.24,10.54 26.16,10.54 42.55,26.92 U1.16
B85_DATA[3]
  Top 0.178: J4.6 24.13,9.02 25.15,10.03 26.29,10.03 43.69,27.43 43.69,27.96 U1.17
B85_DATA[4]
  Top 0.178: J4.7 26.67,9.02 28.32,10.67 29.34,10.67 33.02,14.35 33.02,15.91 43.4,26.29 44.2,26.29 44.96,27.05 44.96,27.96 U1.18
B85_DATA[5]
  Top 0.178: J4.8 29.21,9.78 33.4,13.97 33.4,15.65 43.66,25.91 44.96,25.91 46.35,27.3 U1.19
B85_DATA[6]
  Top 0.178: J4.9 31.75,11.65 33.78,13.69 33.78,15.4 43.91,25.53 45.97,25.53 47.62,27.18 U1.20
B85_DATA[7]
  Top 0.178: J4.10 34.29,15.24 44.2,25.15 46.74,25.15 48.77,27.18 48.77,27.96 U1.21
B85_DIR
  Top 0.178: J3.5 21.59,32.51 22.73,33.66 50.29,33.66 51.44,34.8 U1.2
B85_LMA_N  (via drill 0.38)
  Top 0.178: 27.06,21.08 U3.12 26.8,21.08 24.89,21.08 v24.89,21.21
  Bottom 0.178: v24.89,21.21 24.89,26.54 24.51,26.92 24.51,27.05 22.35,29.21 17.78,29.21 J3.3
B85_OE  (via drill 0.38)
  Top 0.178: J3.9 31.75,31.75 33.02,33.02 48.39,33.02 v48.9,32.51 49.02,32.38 | v48.9,29.97 49.66,29.97 50.16,29.46 U1.22
  Bottom 0.178: v48.9,32.51 v48.9,29.97
B85_PH1_CLK
  Top 0.178: J3.6 24.13,28.45 24.64,27.94 24.64,25.27 24.13,24.77 U3.2
B85_PH2_CLK
  Top 0.178: J3.7 25.15,28.96 25.15,25.15 22.23,22.23 U3.4
B85_RD_N
  Top 0.178: J3.8 25.53,26.8 25.53,23.11 22.1,19.68 U3.6
B85_WR_N  (via drill 0.38)
  Top 0.178: J3.4 20.83,28.7 22.23,28.7 24,26.92 24,26.04 v23.9,26.04 | v25.27,18.29 26.8,18.29 U3.10
  Bottom 0.178: v23.9,26.04 24,25.93 24,19.56 v25.27,18.29
BUS0
  Top 0.178: J1.4 20.32,54.61 21.59,53.34 21.59,46.99 23.03,45.55 R14.2
BUS1
  Top 0.178: J2.5 22.86,48.77 25.15,46.48 25.91,46.48 26.54,45.85 R13.2 26.54,45.97
BUS2
  Top 0.178: R9.2 29.08,47.5 27.94,48.64 J2.7
BUS3
  Top 0.178: J1.8 30.48,54.61 31.71,53.38 31.71,45.64 R8.2 31.5,45.67 31.5,45.97
BUS4
  Top 0.178: R4.2 34.16,47.5 33.02,48.64 J2.9
BUS5
  Top 0.178: J1.10 35.56,54.61 36.87,53.3 36.87,45.72 R3.2
BUS6
  Top 0.178: J2.11 38.1,48.73 39.24,47.59 R10.2
BUS7
  Top 0.178: J1.12 40.64,54.61 41.91,53.34 41.91,45.68 R11.2
CLK1
  Top 0.178: U3.3 20.7,23.5 19.3,22.1 18.16,22.1 17.59,22.67 17.59,27.75 17.78,27.94 17.78,38.1 16.51,39.37 16.51,52.7 15.49,53.72 13.46,53.72 12.7,54.48 J1.1
CLK2
  Top 0.178: U3.5 18.54,20.95 15.24,24.26 J2.2
GND  (via drill 0.38)  (1 unrouted)
  Top 0.178: R12.2 32.47,26 v32.51,26.04 | LED7.C 3.58,30.25 v3.81,30.48 | v29.12,11.73 v29.12,11.72 29.1,11.71 | 41.66,20.61 v41.66,20.57
  Top 0.254: LED7.C LED2.C LED3.C LED4.C 3.56,16.49 3.56,14.22 5.5,12.28 C28.2
  Top 0.305: U3.8 v22.99,17.14 | C2.2 v18.67,22.99
  Top 0.406: U2.2 v49.15,15.88 49.02,15.88 | R1.1 44.24,9.95 43.22,10.97 C13.2 | U1.13 38.73,29.21 39.12,29.59 39.24,29.59 39.38,29.73 v39.38,29.83 | U1.12 38.73,36.83 v39.37,36.2 40.01,36.83 U1.11
  Top 0.508: R1.1 45.25,10.54 45.34,10.54 v45.47,10.67
  Top 0.61: C28.2 12.57,12.28 12.74,12.28 | J3.2 13.97,34.29 12.87,35.39 C27.2 | v41.91,4.45 41.78,4.57 C7.2 42.46,5.63 43.18,6.35 43.18,8.89 44.24,9.95 | C1.2 54.99,40.64 | 54.99,40.64 C3.2 | 54.99,40.64 v55.63,40.64 55.88,40.64 56.26,40.26 v56.26,39.37 C4.2 | C11.2 v54.86,30.73 | C14.- v50.55,20.95 | C14.- 53.1,19.44 53.09,19.43 | 53.09,19.43 v52.96,19.43 | C14.- 53.1,22.34 v52.96,22.48 | J2.4 J2.3 J1.3 J1.2 15.24,57.53 14.86,57.91 8.38,57.91 5.47,55 H2.P1 | J1.5 22.86,54.61 25.4,52.07 J2.6 | J1.9 33.02,54.61 35.56,52.07 J2.10 | J2.12 40.64,52.07 38.1,54.61 J1.11 | J2.17 J1.17 59,56 H3.P1 | v49.15,15.88 v50.04,14.99 50.04,14.86 50.16,14.99 C12.- 51.81,18.16 53.09,19.43 | C13.2 43.22,13.37 v43.31,13.46 | C16.2 42.44,19.94 41.66,20.61
  Top 0.813: J4.2 13.97,11.05 12.74,12.28 | v40.77,19.81 C6.- | 41.66,20.61 40.77,19.72 | v21.21,13.84 v22.73,15.37 22.99,15.62 v22.99,17.14 | v10.16,27.43 v12.57,27.43 | v10.29,14.22 v12.45,14.22 12.57,14.1 12.57,12.28 | 29.1,11.71 v31.11,13.71
  Bottom 0.178: 33.27,26.04 v32.51,26.04 31.11,24.64 v31.11,13.72 26.42,13.72 24.51,15.62 | 2.54,30.48 v3.81,30.48 7.11,30.48 v10.16,27.43 | v54.86,30.73 52.96,28.83 v52.96,22.48 52.07,22.48 v50.55,20.95 49.15,19.56 v49.15,15.88 | v22.99,17.14 24.51,15.62 | v29.12,11.73 23.32,11.73 v21.21,13.84 | 24.51,15.62 22.99,15.62 v22.73,15.37 | v40.77,19.81 40.77,16 v43.31,13.46 43.31,12.83 v45.47,10.67 | 13.97,27.69 12.83,27.69 v12.57,27.43
  Bottom 0.305: v22.99,17.14 23.88,17.14 | 6.19,3.81 H1.P1 | H4.P1 60.96,5.96
  Bottom 0.406: v49.15,15.88 47.24,15.88 46.99,15.88 | 34.54,26.04 38.34,29.83 v39.38,29.83 39.38,36.18 v39.37,36.2
  Bottom 0.508: 17.78,58.29 8.29,58.29 H2.P1 2.54,52.54 2.54,30.48 2.54,7.46 H1.P1 8.38,1.62 8.38,1.52 56.52,1.52 H4.P1 60.12,5 62.23,7.11 62.23,52.77 H3.P1 56.77,58.23 56.77,58.29 53.34,58.29 | 17.78,58.29 22.86,58.29 | 22.86,58.29 27.94,58.29 | 27.94,58.29 33.02,58.29 | 33.02,58.29 38.1,58.29 | 38.1,58.29 43.18,58.29 | 43.18,58.29 48.26,58.29 | 48.26,58.29 53.34,58.29 | J1.15 48.26,58.29 | J1.11 38.1,58.29 | J1.9 33.02,58.29 | J1.7 27.94,58.29 | J1.17 53.34,58.29 | J1.3 17.78,58.29 | v45.47,10.67 45.47,6.73 43.18,4.45 | v40.77,19.81 34.54,26.04 v32.51,26.04 | J1.13 43.18,58.29 | J1.5 22.86,58.29 | v18.67,22.99 13.97,27.69 J3.2 13.97,29.59 15.24,28.32 21.08,28.32 22.99,26.42 v22.99,17.14
  Bottom 0.61: 43.18,4.45 v41.91,4.45 | v54.86,30.73 54.86,39.88 v55.63,40.64 56.26,40.01 v56.26,39.37 | v50.55,20.95 51.44,20.95 v52.96,19.43 | v52.96,22.48 52.32,22.48 | v43.31,13.46 44.83,13.46 47.24,15.88
  Bottom 0.813: v41.66,20.57 40.77,20.57 v40.77,19.81 40.89,19.81
  other vias: 12.57,12.45
  pour Bottom (isolate 0.305, rank 2): 0.25,59.75 64.75,59.75 64.75,0.25 0.25,0.25
LMA_N  (via drill 0.38)
  Top 0.178: U3.11 29.59,19.68 36.96,27.05 36.96,29.97 38.73,31.75 49.78,31.75 52.07,34.04 | 52.07,43.31 v48.26,47.12
  Top 0.2: 52.07,34.04 52.07,43.31
  Bottom 0.178: v48.26,47.12 J2.15
N$1
  Top 0.178: LED2.A 6.58,23.81 R2.1
N$2
  Top 0.406: U4.1 47.2,5.93 R49.1 R1.2
N$3
  Top 0.178: R12.1 30.31,23.37 27.06,23.37 U3.14
N$4
  Top 0.178: R14.1 24,43.18 27.43,39.75 40.77,39.75 41.27,39.24 U1.10
N$5
  Top 0.178: TP1.P$1 U3.15
N$6
  Top 0.178: LED3.A 7.85,19.05 R5.2
N$7
  Top 0.178: LED4.A R6.2
N$8
  Top 0.178: LED7.A 9.31,25.21 R7.2
N$9
  Top 0.178: R13.1 26.54,43.18 29.46,40.26 42.04,40.26 42.55,39.75 U1.9
N$10
  Top 0.178: J12.1 R7.1
N$11
  Top 0.178: R9.1 29.08,43.18 31.5,40.77 42.93,40.77 43.81,39.88 U1.8
N$12
  Top 0.178: R8.1 31.62,43.22 33.57,41.27 44.07,41.27 45.09,40.26 U1.7
N$13
  Top 0.178: 34.29,43.73 R4.1 34.16,43.22 35.58,41.8 45.45,41.8 46.35,40.89 U1.6
N$14
  Top 0.61: J3.1 11.43,33.57 C27.1 | J4.1 C28.1
  Bottom 0.813: J6.1 13.84,5.21 J4.1 J3.1
N$15
  Top 0.178: R3.1 36.7,43.22 37.55,42.37 46.91,42.37 47.62,41.66 U1.5
N$16
  Top 0.178: J10.1 R6.1
N$17
  Top 0.178: J7.1 R5.1
N$18
  Top 0.178: R10.1 39.24,43.22 39.54,42.93 48.13,42.93 48.9,42.16 U1.4
N$19
  Top 0.178: 42.04,43.94 41.87,43.94 R11.1 42.16,43.47 48.48,43.47 49.91,42.04 49.91,38.2 U1.3
N$20
  Bottom 0.178: J3.10 J13.1
RD_N  (via drill 0.38)
  Top 0.178: U3.7 21.36,18.39 23.42,18.39 25.43,16.38 27.56,16.38 37.85,26.67 37.85,29.34 39.37,30.86 51.56,30.86 51.94,31.24 v51.94,32.64 | v51.27,41.11 51.27,42.26 48.32,45.21 45.97,45.21 44.45,46.74 44.45,54.23 45.72,55.5 J1.14
  Bottom 0.178: v51.94,32.64 51.69,32.89 51.69,40.26 51.27,40.67 v51.27,41.11
VIN
  Top 0.61: 58.17,21.22 C14.+
  Top 0.813: D2.C 58.17,21.22 | C14.+ 57.01,20.07 57.01,10.15 52.73,5.87 U4.3
WR_N  (via drill 0.38)
  Top 0.178: U3.9 27.69,17.14 37.39,26.85 37.39,29.74 38.89,31.24 50.04,31.24 50.48,31.69 v51.14,31.69 | v50.8,40.01 50.55,40.26 50.55,42.16 48.26,44.45 44.7,44.45 43.31,45.85 43.31,49.87 J2.13
  Bottom 0.178: v50.8,40.01 50.8,32.03 v51.14,31.69

### Text on the board
tNames: 6V0 | HP85 Tape Emulator DEV | Version -01 | May 16, 2020 | 12V0 | 5V5 | 3V3
Measures: Units in inches
214bmp: D:/SmartProjects/Snc/a4_bn_logo2.bmp